# Altium project IO BOARD CERES-V6.PrjPcb
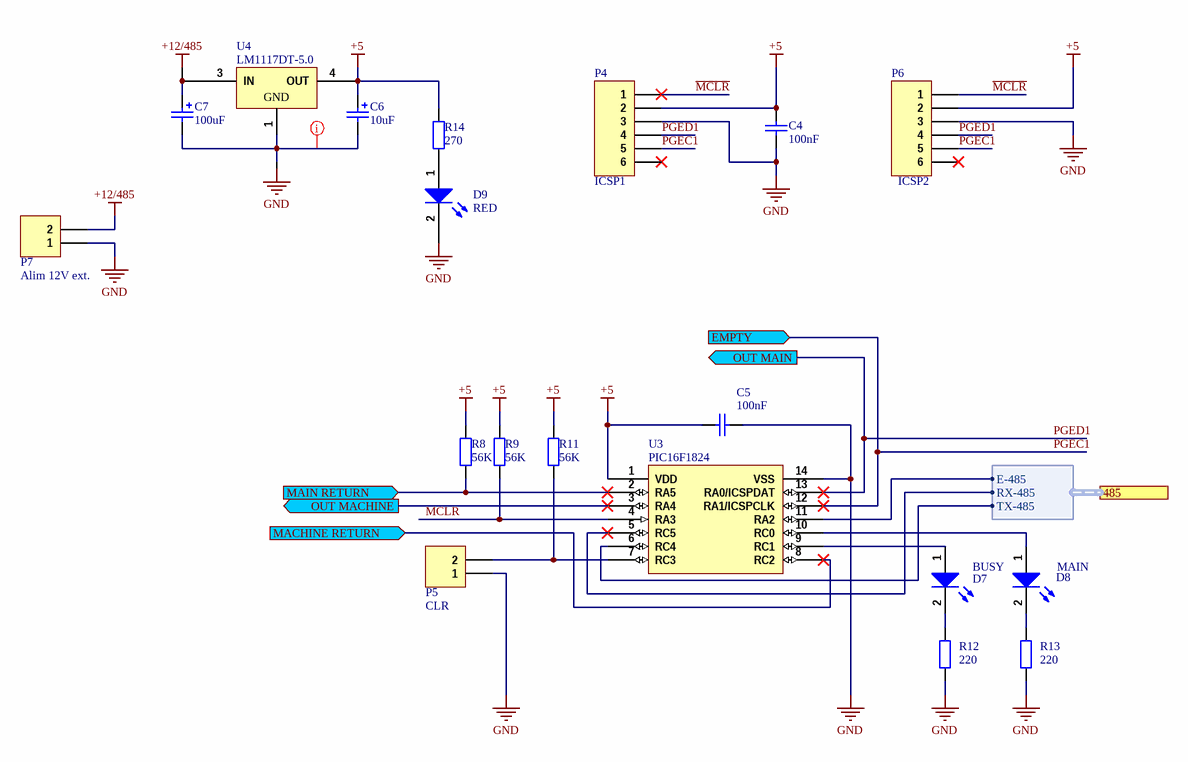
[diagram p0: MCU IO.SchDoc]
3 sheets, 63 parts. Net scope: flat (ports and power ports of the same name join across sheets).
Board file: IO BOARD CERES V6.PcbDoc
Sheets:
  MCU IO.SchDoc
  IO.SchDoc
  RS485 IO.SchDoc

## Sheet MCU IO.SchDoc: MCU
size A4; Date: 30 08 2013; Author: Rachid AKKOUCHE; CompanyName: RASoftware; DrawnBy: Rachid AKKOUCHE; Engineer: Rachid AKKOUCHE; Organization: RASoftware; Address1: 52 J03, rue de la crèche; Address3: 77100 MEAUX; Address4: FRANCE; DocumentNumber: BRA2013090103C2; Revision: C; SheetNumber: 2; SheetTotal: 4; Telephone: +33651604047; Email: rachid.akkouche@wanadoo.fr; Dessinepar: -; Verifiepar: -; Property: RASoftware; Time: 13:00; ProjectName: IO BOARD CERES-V3; Application_BuildNumber: 01

### Parts
C4  100nF  [C0805]
C5  100nF  [C0805]
C6  10uF  [KEMET_4]
C7  100uF  [Kemet_63]
D7  Indicator: BUSY  [0603-LEDR]  (hidden comment: HSMH-C190)
D8  MAIN  [0603-LEDV]  (value not drawn)
D9  Couleur: RED  [0603-LEDR]  (hidden comment: HSMH-C190)
P4  ICSP1  [TC2030]  (no BOM)
P5  CLR  [M20_1X2]
P6  ICSP2  [6SIP100]  (no BOM)
P7  Alim 12V ext.  [CO2P508]  (no BOM)
R8  56K  [R0805]
R9  56K  [R0805]
R11  56K  [R0805]
R12  220  [R0805]
R13  220  [R0805]
R14  270  [R0805]
U3  PIC16F1824  [so-14]
U4  LM1117DT-5.0  [SOT223]

### Ports
485 (harness EIA-485), EMPTY (in), MACHINE RETURN (in), MAIN RETURN (in), OUT MACHINE (out), OUT MAIN (out)

### Harnesses
EIA-485: TX-485, RX-485, E-485

### Nets
+5: C4.2 C5.2 C6.1 P4.2 P6.2 R8.2 R9.2 R11.2 R14.2 U3.1(VDD) U4.4(OUT)
+12/485: C7.1 P7.2 U4.3(IN)
GND: C4.1 C5.1 C6.2 C7.2 D9.2(K) P4.3 P5.1 P6.3 P7.1 R12.1 R13.1 U3.14(VSS) U4.1(GND)
~{MCLR}: P4.1 P6.1 R9.1 U3.4(RA3)
PGEC1: P4.5 P6.5 U3.12(RA1/ICSPCLK) ; port EMPTY
PGED1: P4.4 P6.4 U3.13(RA0/ICSPDAT) ; port OUT MAIN
NetC2_1: R8.1 U3.2(RA5) ; port MAIN RETURN
NetD7_1: D7.1(A) U3.9(RC1)
NetD7_2: D7.2(K) R12.2
NetD8_1: D8.1(A) U3.10(RC0)
NetD8_2: D8.2(K) R13.2
NetD9_1: D9.1(A) R14.1
NetP5_2: P5.2 R11.1 U3.7(RC3)
NetQ2_1: U3.3(RA4) ; port OUT MACHINE
NetR18_2: U3.11(RA2) ; port 485.E-485
NetU2_7: U3.8(RC2) ; port MACHINE RETURN
NetU3_5: U3.5(RC5) ; port 485.RX-485
NetU3_6: U3.6(RC4) ; port 485.TX-485

Not connected (* = marked no-connect by the designer): P4 6*; P6 6*

### Layout directives
rule Width Constraint [Pref Width = 0.55mm    Min Width = 0.254mm    Max Width = 2mm]: GND

### Notes on the sheet
- (near D8) MAIN
- Ce document est la propriété de
- Project:
- Il ne peut être divulgué sans l'accord écrit de l'un de ses représentants dûment mandaté
- Title:
- Number:
- Date:
- Time:
- Size:
- A4
- Revision:
- Sheet
- of
- 52 J03 rue de la crèche
- Draw by:
- 77100 Meaux

### Library data of the parts
C4 C5 = Cap 0805 100nF: Capacitor; Manufacturer: MULTICOMP; Manufacturer Part Number: MCCA000296; Supplier 1: Farnell; Supplier Part Number 1: 1759167; Pricing 1: 100=0,01, 500=0,008, 1000=0,006, 4000=0,005 (EUR); ComponentLink1URL: http://www.farnell.com/datasheets/1520827.pdf; ComponentLink1Description: http://www.farnell.com/datasheets/1520827.pdf
C6 = Cap Pol 10uF: Polarized Capacitor; Manufacturer: KEMET; Manufacturer Part Number: EXV106M025A9BAA; Dielectric Material: Aluminium; Voltage Rating: 25V; Tolerance: 20%; Ripple Current: 90mA; Impedance: 1.93R; Life (Hours): 3000Hour; Leakage Current: 3uA; Dissipation Factor: 0.14%; Lead Length: 1.8mm; ComponentLink1URL: http://www.farnell.com/datasheets/1500293.pdf; ComponentLink1Description: http://www.farnell.com/datasheets/1500293.pdf; Supplier 1: Farnell; Supplier Part Number 1: 2069174RL; Stock 1: 0; Mount: Surface Mount,PCB; Case/Package: Radial; Min Operating Temperature: -40°C; Max Operating Temperature: 105°C; Packaging: Tape and Reel; Package Quantity: 20000; Capacitance: 10uF; Voltage Rating (DC): 25V; Termination: SMD/SMT; Ripple Current (AC): 90mA; Voltage: 25V; ESR (Equivalent Series Resistance): 1.93R; Diameter: 4mm; Length: 5.4mm; Height: 5.4mm; Height - Seated (Max): 0.222inch; Lead Pitch: 1mm; REACH SVHC: No SVHC; ComponentLink2URL: https://datasheet.ciiva.com/22698/1500293-22698077.pdf; ComponentLink2Description: https://datasheet.ciiva.com/22698/1500293-22698077.pdf
C7 = Cap Pol 100uF: Polarized Capacitor; Manufacturer: EPCOS; Manufacturer Part Number: B41142A4107M; Product Range: EPCOS - B41142 Series; Capacité: 100; Tolérance de capacité: ± 20%; Tension: 16; Type de boîtier de condensateur: Radial Can - SMD; Diamètre: 6.3; Résistance, ESR: 0.16; Hauteur: 7.7; Courant d'ondulation c.a.: 300; Type de packaging: Cut Tape; Durée de vie @ température: 2000 heures @ 105; Température d'utilisation min: -55; Température de fonctionnement max..: 105; SVHC: No SVHC (19-Dec-2012); Impédance: 0.26; Température de fonctionnement: -55°C à +105; Température, ESR: 20; Type de boîtier: CMS; Supplier 1: Farnell; RoHS: YES; Pricing 1: 10=0,123, 50=0,095, 100=0,078, 250=0,07, 1000=0,062 (EUR); Courant d'ondulation c.a. à  100Hz: 300; Fréquence, impédance: 100; Longueur/hauteur: 7.7; Température, courant ondulatoire: 105; Température, impédance: 20; ComponentLink1URL: http://www.epcos.com/inf/20/30/db/alu_x/B41142.pdf; ComponentLink1Description: http://www.epcos.com/inf/20/30/db/alu_x/B41142.pdf; Supplier Part Number 1: 1735328
D7 D9 = HSMH-C190: Surface Mount Chip LED, Red; Manufacturer: AVAGO TECHNOLOGIES; Manufacturer Part Number: HSMH-C190.; Taille de lampe: 0.8mm x 1; Couleur de LED: Rouge; Intensité lumineuse: 17; Angle, vision: 170°; Courant, direct, If: 20; Tension, direct à  If: 1.8; Montage LED: CMS; Forme de lentille: Rectangulaire; Longueur d'onde typ.: 626; SVHC: No SVHC (19-Dec-2012); Dissipation de puissance: 65; Intensité lumineuse min. à  If: 2.8; Intensité lumineuse typique: 10; Largeur (externe): 0.8; Longueur d'onde dominante: 639; Longueur d'onde, crête: 630; Longueur/hauteur: 1.6; Matière: AlGaAs; Nombre de broches: 2; Orientation de montage opto: Dessus; Orientation sortie de lumière: Top Emitting; Température de fonctionnement: -30°C à +85; Température de fonctionnement max..: 85; Température, stockage min.: -40; Température d'utilisation min: -30; Tension, Vf max..: 2.6; Tension, Vf min.: 2.1; Type de LED: Standard; Supplier 1: Farnell; Supplier Part Number 1: 8554641; RoHS: YES; Pricing 1: 5=0,06, 25=0,059, 100=0,057, 250=0,052, 500=0,047 (EUR); MSL: MSL 2A - 4 semaines; Couleur, LED: Rouge; Profondeur: 0.8; Température, stockage max..: 85; Tension, Vf typ.: 1.8; ComponentLink1URL: http://www.farnell.com/datasheets/313031.pdf; ComponentLink1Description: http://www.farnell.com/datasheets/313031.pdf; ComponentLink2URL: http://www.farnell.com/datasheets/55927.pdf; ComponentLink2Description: http://www.farnell.com/datasheets/55927.pdf
  D7: Couleur: RED
  D9: Stock 1: 13902
D8 = HSMG-C190: Surface Mount Chip GREEN; Manufacturer: Broadcom Avago; Colour: Green,Yellow; Lens Colour: White,Clear; Forward Voltage: 2.2V; Luminous Intensity: 15mcd; Viewing Angle: 170°; Lens Style: Diffused,Colorless,Rectangular; Forward Current: 20mA; Power Rating: 52mW; Dominant Wavelength: 572nm; Lens Transparency: Diffused; Number of LEDs: 1; Reverse Voltage: 5V; ComponentLink1URL: http://www.farnell.com/datasheets/313031.pdf; ComponentLink1Description: http://www.farnell.com/datasheets/313031.pdf; ComponentLink2URL: http://www.farnell.com/datasheets/55927.pdf; ComponentLink2Description: http://www.farnell.com/datasheets/55927.pdf; ComponentLink3URL: https://datasheet.ciiva.com/11773/0900766b80ad69c9-11773861.pdf; ComponentLink3Description: https://datasheet.ciiva.com/11773/0900766b80ad69c9-11773861.pdf; ComponentLink4URL: https://datasheet.ciiva.com/15117/getdatasheetpartid-110413-15117483.pdf; ComponentLink4Description: https://datasheet.ciiva.com/15117/getdatasheetpartid-110413-15117483.pdf; ComponentLink5URL: https://datasheet.ciiva.com/31395/1487342-31395358.pdf; ComponentLink5Description: https://datasheet.ciiva.com/31395/1487342-31395358.pdf; ComponentLink6URL: https://datasheet.ciiva.com/29280/180659-da-01-en-chip-led-hsmg-c190-gelb-gruen-29280615.pdf; ComponentLink6Description: https://datasheet.ciiva.com/29280/180659-da-01-en-chip-led-hsmg-c190-gelb-gruen-29280615.pdf; ComponentLink7URL: https://datasheet.ciiva.com/46426/313031-46426519.pdf; ComponentLink7Description: https://datasheet.ciiva.com/46426/313031-46426519.pdf; ComponentLink8URL: https://datasheet.ciiva.com/46426/313031-46426520.pdf; ComponentLink8Description: https://datasheet.ciiva.com/46426/313031-46426520.pdf; ComponentLink9URL: https://datasheet.ciiva.com/14172/swseriehsmx-c150toc190-e-14172173.pdf; ComponentLink9Description: https://datasheet.ciiva.com/14172/swseriehsmx-c150toc190-e-14172173.pdf; Supplier 1: Farnell; Manufacturer Part Number: HSMG-C190; Stock 1: 0; Mount: Surface Mount; Case/Package: 0603; Number of Pins: 2; Case Code (Metric): 1608; Case Code (Imperial): 0603; Contact Plating: Gold; Min Operating Temperature: -40°C; Max Operating Temperature: 85°C; Packaging: Tape and Reel; Package Quantity: 1; Illumination Colour: Green; Test Current: 20mA; Wavelength: 572nm; Number of Elements: 1; Power Dissipation: 52mW; Max Power Dissipation: 52mW; Length: 1.6mm; Height: 0.8mm; Width: 0.8mm; Depth: 0.8mm; Radiation Hardening: No; REACH SVHC: No SVHC; Lead Free: Lead Free; Supplier Part Number 1: 8554609; Parameter 1: *
P4 = Header 6: Header, 6-Pin; Manufacturer: HARWIN; Manufacturer Part Number: M20-8770642; Type de connecteur: Contact fil-à-carte; Série: M20; Terminaison du contact: Montage en surface vertical; Genre: Embase; Nombre de contacts: 6; Nombre de rangées: 1; Pas: 2.54; Plaquage du contact: Or; Matériau du contact: Laiton; SVHC: No SVHC (19-Dec-2012); Supplier 1: Farnell; Supplier Part Number 1: 1517384; RoHS: YES; Stock 1: 3471; Pricing 1: 10=0,69, 20=0,66, 50=0,62, 100=0,6, 250=0,56, 500=0,49 (EUR); Pas, rang: 2.54; ComponentLink1URL: http://www.farnell.com/datasheets/1089524.pdf; ComponentLink1Description: http://www.farnell.com/datasheets/1089524.pdf; ComponentLink2URL: http://www.farnell.com/datasheets/5481.pdf; ComponentLink2Description: http://www.farnell.com/datasheets/5481.pdf
P5 = Header 2: Header, 2-Pin; Manufacturer: HARWIN; Manufacturer Part Number: M20-8770242; LatestRevisionDate: 17-Jul-2002; LatestRevisionNote: Re-released for DXP Platform.; Publisher: Altium Limited; Supplier 1: Farnell; Supplier Part Number 1: 1895211; RoHS: YES; Pricing 1: 10=0,137, 20=0,136, 50=0,135, 100=0,133, 250=0,128, 500=0,12 (EUR); ComponentLink1URL: http://www.farnell.com/cad/1330190.pdf; ComponentLink1Description: http://www.farnell.com/cad/1330190.pdf
P6 = Header 6: Header, 6-Pin; Manufacturer: TE CONNECTIVITY / AMP; Manufacturer Part Number: 4-103321-8.; Série: AMPMODU; Pas: 2.54; Nombre de rangées: 1; Nombre de contacts: 40; Genre: Embase; Terminaison du contact: A souder; Plaquage du contact: Etain; Matériau du contact: Bronze phosphoreux; Courant: 3; Matériau isolant: Thermoplastique; Organismes d'agrément: CSA, UL; Résistance d'isolement: 500; Température de fonctionnement max..: 105; Température d'utilisation min: -65; Type de boitier: Plastique noir UL94V-0; Supplier 1: Farnell; Supplier Part Number 1: 1098454; RoHS: YES; Stock 1: 2602; Pricing 1: 1=2,12, 50=1,79, 100=1,34, 500=1,14, 1000=1,05 (EUR); Méthode de terminaison: A souder; ComponentLink1URL: http://www.tycoelectronics.com/commerce/DocumentDelivery/DDEController?Action=srchrtrv&DocNm=4-103321-8&DocType=Customer+View+Model&DocLang=English; ComponentLink1Description: http://www.tycoelectronics.com/commerce/DocumentDelivery/DDEController?Action=srchrtrv&DocNm=4-103321-8&DocType=Customer+View+Model&DocLang=English; ComponentLink2URL: http://www.farnell.com/datasheets/38278.pdf; ComponentLink2Description: http://www.farnell.com/datasheets/38278.pdf
P7 = Header 2: Header, 2-Pin
R8 R9 R11 = Resistor 0805 56K: Resistor; Manufacturer: MULTICOMP; Manufacturer Part Number: MC0.1W08051%56KFR; Product Range: MULTICOMP - MC Series; Résistance: 56; Puissance: 100; Tolérance de résistance: ± 1%; Type de boîtier de résistance: 0805; Type de résistance: Couche épaisse; Coefficient de température: ± 100; Tension: 150; Type de packaging: Full Reel; Resistor Mounting: CMS; Resistor Terminals: (Non Disponible); Supplier 1: Farnell; RoHS: YES; Pricing 1: 5000=0,001 (EUR); MSL: (Non Applicable); ComponentLink1URL: http://www.farnell.com/datasheets/1716700.pdf; ComponentLink1Description: http://www.farnell.com/datasheets/1716700.pdf; Supplier Part Number 1: 2129258
R12 R13 = Resistor 0805 220: Resistor; Manufacturer: MULTICOMP; Manufacturer Part Number: MC01W08051220R; Gamme de produit: MULTICOMP - MC Series; Puissance: 100; Tolérance de résistance: ± 1%; Type de boîtier de résistance: 0805; Type de résistance: Couche épaisse; Coefficient de température: ± 100; Tension: 150; Type de packaging: Bande et Bobine; SVHC: No SVHC (20-Jun-2013); Montage de résistance: CMS; Quantité par bobine: 5000; Supplier 1: Farnell; RoHS: YES; Stock 1: 199995; Pricing 1: 5000=0,001, 25000=0,0009, 50000=0,0008 (EUR); Résistance: 220; MSL: -; ComponentLink1URL: http://www.farnell.com/datasheets/1729047.pdf; ComponentLink1Description: http://www.farnell.com/datasheets/1729047.pdf; Supplier Part Number 1: 2129060
R14 = Resistor 0805 1K: Resistor; Manufacturer: MULTICOMP; Manufacturer Part Number: MC0.1W08051%1KFR; Product Range: MULTICOMP - MC Series; Résistance: 1; Puissance: 100; Tolérance de résistance: ± 1%; Type de boîtier de résistance: 0805; Type de résistance: Couche épaisse; Coefficient de température: ± 100; Tension: 150; Type de packaging: Full Reel; Resistor Mounting: CMS; Supplier 1: Farnell; RoHS: YES; Pricing 1: 5000=0,001 (EUR); MSL: MSL 1 - Illimité; ComponentLink1URL: http://www.farnell.com/datasheets/1716700.pdf; ComponentLink1Description: http://www.farnell.com/datasheets/1716700.pdf; Supplier Part Number 1: 2129113
U3 = PIC16(L)F1824: 14 Pin Flash Microcontrollers with XLP Technology; Manufacturer: MICROCHIP; Manufacturer Part Number: PIC16F1824-I/SL; Supplier 1: Farnell; RoHS: YES; Stock 1: 516; ComponentLink1URL: http://www.farnell.com/datasheets/1669488.pdf; ComponentLink1Description: http://www.farnell.com/datasheets/1669488.pdf; ComponentLink2URL: http://www.farnell.com/cad/1689044.zip; ComponentLink2Description: http://www.farnell.com/cad/1689044.zip; Supplier Part Number 1: 1814945
U4 = LM1117DT-5.0: 800mA Low-Dropout Linear Regulator, 3-pin TO-252; Manufacturer: TEXAS INSTRUMENTS; Manufacturer Part Number: LM1117MP-5.0; Supplier 1: Farnell; Supplier Part Number 1: 9778209; RoHS: YES; Pricing 1: 1=0,9, 10=0,86, 100=0,73 (EUR); ComponentLink1URL: http://www.farnell.com/datasheets/1685500.pdf; ComponentLink1Description: http://www.farnell.com/datasheets/1685500.pdf; ComponentLink2URL: http://www.farnell.com/cad/1562101.zip; ComponentLink2Description: http://www.farnell.com/cad/1562101.zip

## Sheet IO.SchDoc: IO
size A4; Date: 31 08 2013; Author: Rachid AKKOUCHE; CompanyName: RASoftware; DrawnBy: Rachid AKKOUCHE; Engineer: Rachid AKKOUCHE; Organization: RASoftware; Address1: 52 J03, rue de la crèche; Address2: 77100 MEAUX; Address3: FRANCE; DocumentNumber: BRA2013090103C3; Revision: C; SheetNumber: 3; SheetTotal: 4; Telephone: +33651604047; Email: rachid.akkouche@wanadoo.fr; Dessinepar: -; Verifiepar: -; Property: RASoftware; PageSetup: Record=PageOptions|CenterHorizontal=True|CenterVertical=True|PrintScale=0.97|XCorrection=1.00|YCorrection=1.00|PrintKind=0|BorderSize=5000000|LeftOffset=0|BottomOffset=0|Orientation=2|PaperLength=1000|PaperWidth=1000|Scale=100|PaperSource=7|PrintQuality=-3|MediaType=1|DitherType=10|PrintScaleMode=1|PaperKind=16K|PaperIndex=409; Time: 13:22
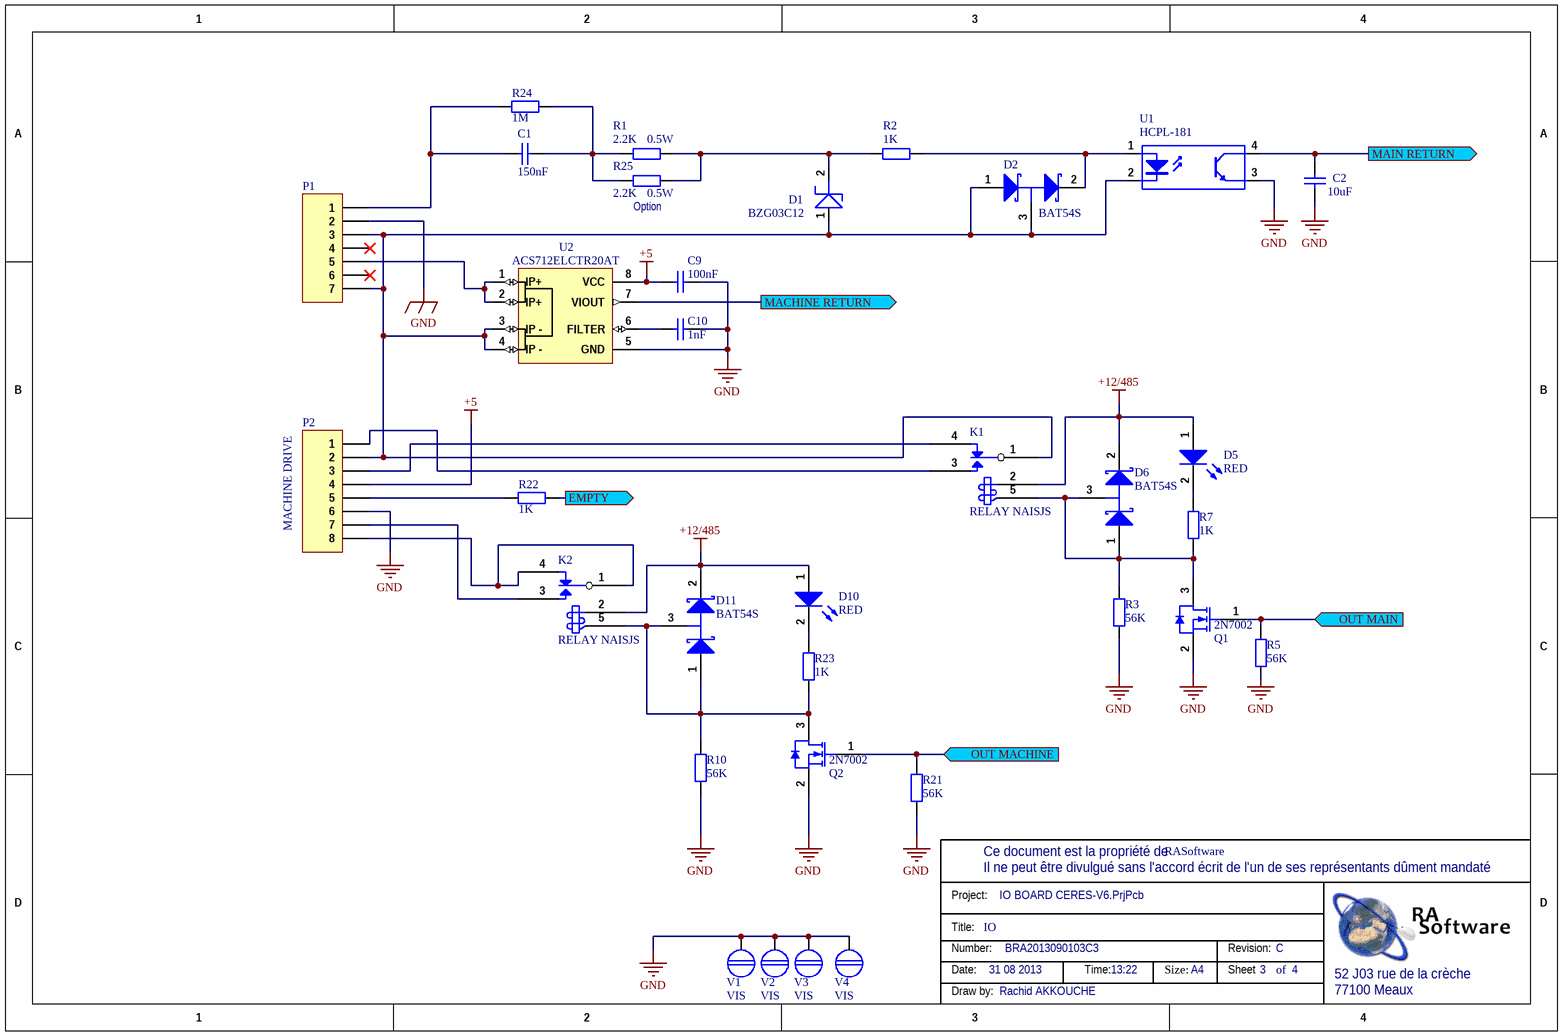
[diagram p1: IO.SchDoc]

### Parts
C1  150nF  [C1210]
C2  10uF  [C0805]
C9  100nF  [C0805]
C10  1nF  [C0805]
D1  BZG03C12  [sma]
D2  BAT54S  [SOT23]
D5  Couleur: RED  [0603-LEDR]  (hidden comment: HSMH-C190)
D6  BAT54S  [SOT23]
D10  Couleur: RED  [0603-LEDR]  (hidden comment: HSMH-C190)
D11  BAT54S  [SOT23]
K1  RELAY NAISJS  [RELAIG5L]
K2  RELAY NAISJS  [RELAIG5L]
P1  Header 7  [CO7P508-90]  (value not drawn)
P2  Header 8  [CO8P508 - 90°]  (value not drawn)
Q1  2N7002  [SOT23]
Q2  2N7002  [SOT23]
R1  2.2K  Power: 0.5W  [1206]
R2  1K  [R0805]
R3  56K  [R0805]
R5  56K  [R0805]
R7  1K  [R0805]
R10  56K  [R0805]
R21  56K  [R0805]
R22  1K  [R0805]
R23  1K  [R0805]
R24  1M  [R1206]
R25  2.2K  Power: 0.5W  [1206]
U1  HCPL-181  [OPTO-4PIN]
U2  Supplier Part Number 1: ACS712ELCTR20AT  [SOIC8]  (hidden comment: ACS712)
V1  VIS  [vis42]
V2  VIS  [vis42]
V3  VIS  [vis42]
V4  VIS  [vis42]

### Ports
EMPTY (out), MACHINE RETURN (out), MAIN RETURN (out), OUT MACHINE (in), OUT MAIN (in)

### Nets
+5: C9.2 P2.4 U2.8(VCC)
+12/485: D5.1(A) D6.2(K) D10.1(A) D11.2(K) K1.2(COIL1) K2.2(COIL1)
GND: C2.2 C9.1 C10.2 P1.2 P2.6 Q1.2(S) Q2.2(S) R3.1 R5.1 R10.1 R21.1 U1.3(E) U2.5(GND) V1.1 V2.1 V3.1 V4.1
PGEC1: R22.1 ; port EMPTY
PGED1: Q1.1(G) R5.2 ; port OUT MAIN
NetC1_1: C1.1 P1.1 R24.2
NetC1_2: C1.2 R1.2 R24.1 R25.2
NetC2_1: C2.1 U1.4(C) ; port MAIN RETURN
NetC10_1: C10.1 U2.6(FILTER)
NetD1_1: D1.1 D2.1(A) D2.3(C) K1.1(COMMON) P1.3 P1.7 P2.2 U1.2(K) U2.3(IP_-) U2.4(IP_-)
NetD1_2: D1.2 R1.1 R2.1 R25.1
NetD2_2: D2.2(K) R2.2 U1.1(A)
NetD5_2: D5.2(K) R7.2
NetD6_1: D6.1(A) D6.3(C) K1.5(COIL2) Q1.3(D) R3.2 R7.1
NetD10_2: D10.2(K) R23.2
NetD11_1: D11.1(A) D11.3(C) K2.5(COIL2) Q2.3(D) R10.2 R23.1
NetK1_3: K1.3(NO) P2.1
NetK1_4: K1.4(NC) P2.3
NetK2_1: K2.1(COMMON) K2.4(NC) P2.8
NetK2_3: K2.3(NO) P2.7
NetP1_5: P1.5 U2.1(IP+) U2.2(IP+)
NetP2_5: P2.5 R22.2
NetQ2_1: Q2.1(G) R21.2 ; port OUT MACHINE
NetU2_7: U2.7(VIOUT) ; port MACHINE RETURN

Not connected (* = marked no-connect by the designer): P1 4* 6*

### Notes on the sheet
- (near R25) Option
- (near P2) MACHINE DRIVE
- Ce document est la propriété de
- Project:
- Il ne peut être divulgué sans l'accord écrit de l'un de ses représentants dûment mandaté
- Title:
- Number:
- Date:
- Time:
- Size:
- A4
- Revision:
- Sheet
- of
- 52 J03 rue de la crèche
- Draw by:
- 77100 Meaux

### Library data of the parts
C1 = Cap: Capacitor; Manufacturer: KEMET; Manufacturer Part Number: C1210V154KCRACTU; Gamme de produit: KEMET - ArcShield V Series; Capacité: 0.15; Tolérance de capacité: ± 10%; Diélectrique: X7; Tension: 500; Boîtier de condensateur Céramique: 1210 [3225 Metric]; Température d'utilisation min: -55; Température de fonctionnement max..: 125; Type de packaging: Bande découpée; SVHC: No SVHC (16-Dec-2013); Bornes de condensateur: CMS; Température de fonctionnement: -55°C à +125; Type de boîtier de condensateur: 1210 [3225 Metric]<!--FANDB--><div class="features-and-benefits-container"></div>; Supplier 1: Farnell; Supplier Part Number 1: 2085200; RoHS: YES; Pricing 1: 10=0,34, 50=0,28, 100=0,154, 500=0,125, 2500=0,097 (EUR); MSL: MSL 1 - Illimité; Tolérance de capacité ±: ± 10%; ComponentLink1URL: http://www.farnell.com/datasheets/1698777.pdf; ComponentLink1Description: http://www.farnell.com/datasheets/1698777.pdf
C2 = Cap 0805 1uF: Capacitor; Manufacturer: YAGEO; Manufacturer Part Number: CC0805KKX5R5BB106; Unit: pcs; SuppliedAmount: 3000; MinAmount: 100; Capacitor type: ceramic; Capacitor kind: MLCC; Capacitance: 10µF; Operating voltage: 6.3V; Dielectric: X5R; Tolerance: ±10%; Supplier Part Number 1: CC0805KKX5R5106; Category: 0805 MLCC SMD Capacitors; Stock 1: 19000; Weight: 0,034; Multiples: 100; Mounting: SMD; Case: 0805; ComponentLink1URL: http://www.tme.eu/en/details/cc0805kkx5r5106/0805-mlcc-smd-capacitors/yageo/cc0805kkx5r5bb106/; ComponentLink1Description: http://www.tme.eu/en/details/cc0805kkx5r5106/0805-mlcc-smd-capacitors/yageo/cc0805kkx5r5bb106/
C9 = Cap 0805 100nF: as C4 on sheet MCU IO; Supplier 1: Farnell; Supplier Part Number 1: 1759167; Pricing 1: 100=0,01, 500=0,008, 1000=0,006, 4000=0,005 (EUR); ComponentLink1URL: http://www.farnell.com/datasheets/1520827.pdf; ComponentLink1Description: http://www.farnell.com/datasheets/1520827.pdf
C10 = Cap 0805 1nF: Capacitor; Manufacturer: SAMSUNG; Manufacturer Part Number: CL05B102KB5NNNC; Unit: pcs; SuppliedAmount: 10000; MinAmount: 300; Multiples: 100; Type de condensateur: céramique; Tye de condensateur: MLCC; Tension de travail: 50V; Diélectrique: X7R; Tolérance: ±10%; Montage: SMD; Boîtier: 0402; Température de travail: -55...125°C; Supplier 1: TME; Category: Condensateurs MLCC SMD 0402; Stock 1: 25000; Pricing 1: 300=0,00208, 1000=0,00124, 10000=0,00069, 40000=0,00066, 100000=0,00064 (EUR); Weight: 0,012; Price Type: NET; Capacité: 1nF; Fabricant: SAMSUNG; ComponentLink1URL: http://www.tme.eu/fr/details/cl05b102kb5nnnc/condensateurs-mlcc-smd-0402/samsung/; ComponentLink1Description: http://www.tme.eu/fr/details/cl05b102kb5nnnc/condensateurs-mlcc-smd-0402/samsung/; Supplier Part Number 1: CL05B102KB5NNNC
D1 = DZ: Manufacturer: VISHAY; Manufacturer Part Number: BZG03C12TR3; Supplier 1: Farnell; Supplier Part Number 1: 9398090; RoHS: YES; Pricing 1: 5=0,62, 100=0,37, 1500=0,26, 3000=0,138, 7000=0,135, 30000=0,132, 30000=0,129 (EUR); ComponentLink1URL: http://www.farnell.com/datasheets/69906.pdf; ComponentLink1Description: http://www.farnell.com/datasheets/69906.pdf
D2 D6 D11 = BAT54S: Schottky Barrier Double Diode; Manufacturer: MULTICOMP; Courant, If moy.: 200; Tension, Vrrm: 30; Tension, Vf max..: 400; Temps trr max.: 5; Courant, Ifs max.: 600; Type de boîtier diode: SOT-23; Nombre de broches: 3; SVHC: No SVHC (19-Dec-2012); Configuration diode: Dual Series; Température, Tj max..: 150; Type de terminaison: SMD; Température d'utilisation min: -55; Courant, If, Vf: 10; Courant, Ir, max..: 2; Marquage, CMS: L44; Température de fonctionnement: -55°C à +150; Supplier 1: Farnell; Supplier Part Number 1: 1621835; Manufacturer Part Number: BAT54S; RoHS: YES; Stock 1: 52055; Pricing 1: 10=0,102, 250=0,074, 1000=0,06, 3000=0,053 (EUR); Diode Type: Schottky; Type de boîtier: SOT-23; courant Ifsm: 600; ComponentLink1URL: http://www.farnell.com/datasheets/1317753.pdf; ComponentLink1Description: http://www.farnell.com/datasheets/1317753.pdf; Température de fonctionnement max..: 150
D5 D10 = HSMH-C190: as D7 on sheet MCU IO; Supplier 1: Farnell; Supplier Part Number 1: 8554641; RoHS: YES; Pricing 1: 5=0,06, 25=0,059, 100=0,057, 250=0,052, 500=0,047 (EUR); MSL: MSL 2A - 4 semaines; Couleur, LED: Rouge; Profondeur: 0.8; Température, stockage max..: 85; Tension, Vf typ.: 1.8; ComponentLink1URL: http://www.farnell.com/datasheets/313031.pdf; ComponentLink1Description: http://www.farnell.com/datasheets/313031.pdf; ComponentLink2URL: http://www.farnell.com/datasheets/55927.pdf; ComponentLink2Description: http://www.farnell.com/datasheets/55927.pdf
K1 K2 = RELAY NAISJS: Manufacturer: OMRON ELECTRONIC COMPONENTS; Manufacturer Part Number: G5LA1A412DC; Type de relais: Puissance; Tension, bobine c.c. nom.: 12; Courant de contact max..: 10; Tension AC nominale du contact: 250; Tension DC nominale du contact: 24; Résistance, bobine: 400; Configuration des contacts: SPST-NO; Type de bobine: CC; Courant de bobine: 30; Puissance de fonctionnement nominale: 360; Montage relais: Traversant; Largeur (externe): 15.8; Profondeur: 19.8; SVHC: No SVHC (20-Jun-2013); Supplier 1: Farnell; Supplier Part Number 1: 2213790; RoHS: YES; Pricing 1: 1=0,84, 10=0,74, 50=0,66, 100=0,59, 250=0,54 (EUR); Hauteur, dimension externe: 15.8; ComponentLink1URL: http://www.farnell.com/datasheets/1648381.pdf; ComponentLink1Description: http://www.farnell.com/datasheets/1648381.pdf
P1 = Header 7: Header, 7-Pin; Manufacturer: FCI; Manufacturer Part Number: 20020110-H071A01LF; Anschlussart: Löten; Anzahl der Kontakte: 7; Anzahl der Reihen: 1; Betriebsspannung: 300 V ac; Breite: 12mm; Farbe: Grün; Gehäuseausrichtung: Rechtwinklig; Gender: Male; Länge: 37.56mm; Montagetyp: Durchsteckmontage; Nennstrom: 12A; Raster: 5.08mm; Serie: 06-508; Tiefe: 8.5mm; Typ: Stiftsockel; Currency: ÿNILÿ; Product StockNumber: 707-5477; Connecteur femelle: 790-0714; LatestRevisionDate: 17-Jul-2002; LatestRevisionNote: Re-released for DXP Platform.; Publisher: Altium Limited; Supplier 1: RS-Components; Supplier Part Number 1: 707-5477; RoHS: Compliant; Category: Steckverbinder; Stock 1: 0; Pricing 1: 5=0,778, 375=0,682, 1250=0,584, 2500=0,486, 5000=0,39 (ÿNILÿ); Material: Nylon; Product Status: ÿNILÿ; Future Stock Date: ÿNILÿ
P2 = Header 8: Header, 8-Pin; Manufacturer: CAMDENBOSS; Manufacturer Part Number: CTB9350/8AO; Gamme de produit: CAMDENBOSS - CTB9350; Type de terminaison de contact: Traversant; Genre: Mâle; Nombre de contacts: 8; Nombre de rangées: 1; Pas: 5; Plaquage du contact: Cuivre; Matériau du contact: Laiton; SVHC: No SVHC (16-Jun-2014); Couleur: vert; Courant: 12; Inflammabilité: UL94V-0; Matériau, vis: Acier; Méthode de terminaison: A souder; Taille du filetage: M3; Température de fonctionnement max..: 125; Température d'utilisation min: -20; Tension nominale Vac: 380; Terminaison du contact: Traversant à angle droit<!--FANDB--><div class="features-and-benefits-container"></div>; Connecteur femelle: 3881891; LatestRevisionDate: 17-Jul-2002; LatestRevisionNote: Re-released for DXP Platform.; Publisher: Altium Limited; Supplier 1: Farnell; Supplier Part Number 1: 3882251; RoHS: YES; Pricing 1: 1=0,963, 25=0,847, 100=0,793, 250=0,732, 700=0,659, 3000=0,581, 3000=0,523, 20000=0,471 (EUR); ComponentLink1URL: http://www.farnell.com/datasheets/1708040.pdf; ComponentLink1Description: http://www.farnell.com/datasheets/1708040.pdf
Q1 Q2 = 2N7002: N-channel Enhancement Mode Field-effect Transistor; Manufacturer: FAIRCHILD SEMICONDUCTOR; Supplier 1: Farnell; Supplier Part Number 1: 9845313; Manufacturer Part Number: 2N7002; RoHS: YES; Pricing 1: 5=0,138, 25=0,13, 100=0,059, 1000=0,049, 3000=0,026, 6000=0,0234 (EUR); ComponentLink1URL: http://www.farnell.com/datasheets/660093.pdf; ComponentLink1Description: http://www.farnell.com/datasheets/660093.pdf; ComponentLink2URL: http://www.farnell.com/datasheets/410597.pdf; ComponentLink2Description: http://www.farnell.com/datasheets/410597.pdf
R1 R25 = Resistor 2.2K 1/2W: Resistor 1/2W; Manufacturer: ROYAL OHM; Manufacturer Part Number: HP06W2F2201T5E; Unit: pcs; SuppliedAmount: 5000; MinAmount: 50; Multiples: 1; Resistance: 2.2kΩ; Tolerance: ±1%; Max. operating voltage: 200V; Max. overload voltage: 400V; Supplier 1: TME; Category: 1206 SMD Resistors; Stock 1: 7150; Pricing 1: 50=0.01633, 250=0.00998, 1000=0.00726, 5000=0.00526, 15000=0.00481 (EUR); Weight: 0.035; Resistor type: thick film; Mounting: SMD; Case: 1206; Operating temperature: -55...155°C; Price Type: NET; ComponentLink1URL: http://static.tme.eu/products_pics/f/9/e/f9e1b74986ef91100415c120c46fcd3c/59135.jpg; ComponentLink1Description: http://static.tme.eu/products_pics/f/9/e/f9e1b74986ef91100415c120c46fcd3c/59135.jpg; Supplier Part Number 1: HP06-2K21%
R2 = Res2: Resistor; Manufacturer: MULTICOMP; Manufacturer Part Number: MC0.1W08051%1KFR; Product Range: MULTICOMP - MC Series; Résistance: 1; Puissance: 100; Tolérance de résistance: ± 1%; Type de boîtier de résistance: 0805; Type de résistance: Couche épaisse; Coefficient de température: ± 100; Tension: 150; Type de packaging: Full Reel; Resistor Mounting: CMS; Supplier 1: Farnell; Supplier Part Number 1: 2129113; RoHS: YES; Stock 1: 599995; Pricing 1: 5000=0,001 (EUR); MSL: MSL 1 - Illimité; ComponentLink1URL: http://www.farnell.com/datasheets/1636796.pdf; ComponentLink1Description: http://www.farnell.com/datasheets/1636796.pdf
R3 R5 R10 R21 = Resistor 0805 56K: as R8 on sheet MCU IO; Supplier 1: Farnell; RoHS: YES; Pricing 1: 5000=0,001 (EUR); MSL: (Non Applicable); ComponentLink1URL: http://www.farnell.com/datasheets/1716700.pdf; ComponentLink1Description: http://www.farnell.com/datasheets/1716700.pdf; Supplier Part Number 1: 2129258
R7 R22 R23 = Resistor 0805 1K: as R14 on sheet MCU IO; Supplier 1: Farnell; RoHS: YES; Pricing 1: 5000=0,001 (EUR); MSL: MSL 1 - Illimité; ComponentLink1URL: http://www.farnell.com/datasheets/1716700.pdf; ComponentLink1Description: http://www.farnell.com/datasheets/1716700.pdf; Supplier Part Number 1: 2129113
R24 = Resistor 1206 1M: Resistor; Manufacturer: Multicomp; Manufacturer Part Number: MCHP06W2F1004T5E; Resistance: 1MR; Power Rating: 500mW; Tolerance: 1%; Voltage Rating: 200V; Temperature Coefficient: 100ppm/°C; Voltage Rating (DC): 50V; ComponentLink1URL: http://www.farnell.com/datasheets/2254497.pdf; ComponentLink1Description: http://www.farnell.com/datasheets/2254497.pdf; ComponentLink2URL: http://www.farnell.com/datasheets/1718548.pdf; ComponentLink2Description: http://www.farnell.com/datasheets/1718548.pdf; ComponentLink3URL: http://www.farnell.com/cad/1697909.zip; ComponentLink3Description: http://www.farnell.com/cad/1697909.zip; Supplier 1: Farnell; Stock 1: 0; Case/Package: 1206; Number of Pins: 2; Case Code (Metric): 3216; Case Code (Imperial): 1206; Min Operating Temperature: -55°C; Max Operating Temperature: 155°C; Packaging: Cut Tape; Composition: Thick Film; Width: 1.55mm; REACH SVHC: No SVHC; ComponentLink4URL: https://datasheet.ciiva.com/7918/1739503-7918901.pdf; ComponentLink4Description: https://datasheet.ciiva.com/7918/1739503-7918901.pdf; ComponentLink5URL: https://datasheet.ciiva.com/7392/43481-7392806.pdf; ComponentLink5Description: https://datasheet.ciiva.com/7392/43481-7392806.pdf; Supplier Part Number 1: 1576679
U1 = Optoisolator1: 4-Pin Phototransistor Optocoupler; Manufacturer: AVAGO TECHNOLOGIES; Manufacturer Part Number: HCPL-181-00AE; Supplier 1: Farnell; Supplier Part Number 1: 1244526RL; RoHS: YES; Pricing 1: 150=0,27, 250=0,217, 500=0,191, 2000=0,143, 2000=0,14, 20000=0,137 (EUR); ComponentLink1URL: http://www.farnell.com/datasheets/317140.pdf; ComponentLink1Description: http://www.farnell.com/datasheets/317140.pdf
U2 = ACS712: HALL EFFECT CURRENT SENSOR; Manufacturer: ALLEGRO MICROSYSTEMS; Manufacturer Part Number: ACS712ELCTR-20A-T; Unit: pcs; SuppliedAmount: 10; MinAmount: 1; Type de capteur: Hall effet; Tension d'alimentation: 8V DC; Courant d'entrée: ± 20A; Température de travail: -40...85°C; Supplier 1: TME; Category: Capteurs de Hall; Stock 1: 844; Pricing 1: 1=3,39, 3=3,16, 10=2,92 (EUR); Weight: 0,336; Multiples: 1; Price Type: NET; Fabricant: ALLEGRO MICROSYSTEMS; ComponentLink1URL: http://www.tme.eu/fr/details/acs712elctr20at/capteurs-de-hall/allegro-microsystems/acs712elctr-20a-t/; ComponentLink1Description: http://www.tme.eu/fr/details/acs712elctr20at/capteurs-de-hall/allegro-microsystems/acs712elctr-20a-t/

## Sheet RS485 IO.SchDoc: RS-485
size A4; Date: 31 08 2013; Author: Rachid AKKOUCHE; CompanyName: RASoftware; DrawnBy: Rachid AKKOUCHE; Engineer: Rachid AKKOUCHE; Organization: RASoftware; Address1: 52 J03, rue de la crèche; Address2: 77100 MEAUX; Address3: FRANCE; DocumentNumber: BRA2013090103C4; Revision: C; SheetNumber: 4; SheetTotal: 4; Telephone: +33651604047; Email: rachid.akkouche@wanadoo.fr; Dessinepar: -; Verifiepar: -; Property: RASoftware; Time: 13:22
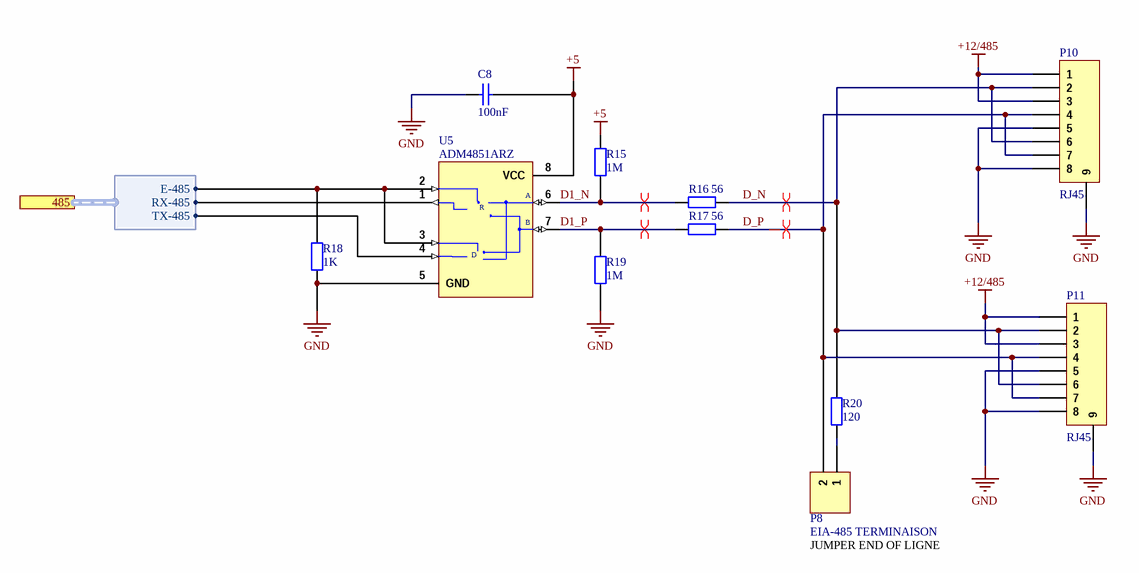
[diagram p2: RS485 IO.SchDoc]

### Parts
C8  100nF  [C0805]
P8  EIA-485 TERMINAISON  [M20_1X2]
P10  RJ45  [RJ45_8-5406721-1]
P11  RJ45  [RJ45_8-5406721-1]
R15  1M  [R0805]
R16  56  [R0805]
R17  56  [R0805]
R18  1K  [R0805]
R19  1M  [R0805]
R20  120  [R0805]
U5  ADM4851ARZ  [SOIC8]

### Ports
485 (harness EIA-485)

### Harnesses
EIA-485: TX-485, RX-485, E-485

### Nets
+5: C8.1 R15.2 U5.8(VCC)
+12/485: P10.1 P10.3 P11.1 P11.3
GND: C8.2 P10.5 P10.8 P10.9 P11.5 P11.8 P11.9 R18.1 R19.1 U5.5(GND)
D1_N: R15.1 R16.1 U5.6(A)
D1_P: R17.1 R19.2 U5.7(B)
D_N: P10.2 P10.6 P11.2 P11.6 R16.2 R20.2
D_P: P8.2 P10.4 P10.7 P11.4 P11.7 R17.2
NetP8_1: P8.1 R20.1
NetR18_2: R18.2 U5.2(~{RE}) U5.3(DE) ; port 485.E-485
NetU3_5: U5.1(RO) ; port 485.RX-485
NetU3_6: U5.4(DI) ; port 485.TX-485

### Layout directives
differential pair: D1_N, D1_P, D_N, D_P

### Notes on the sheet
- JUMPER END OF LIGNE
- Ce document est la propriété de
- Project:
- Il ne peut être divulgué sans l'accord écrit de l'un de ses représentants dûment mandaté
- Title:
- Number:
- Date:
- Time:
- Size:
- A4
- Revision:
- Sheet
- of
- 52 J03 rue de la crèche
- Draw by:
- 77100 Meaux
- (in symbol MAX485ESA) R; D

### Library data of the parts
C8 = Cap 0805 100nF: as C4 on sheet MCU IO; Supplier 1: Farnell; Supplier Part Number 1: 1759167; Pricing 1: 100=0,01, 500=0,008, 1000=0,006, 4000=0,005 (EUR); ComponentLink1URL: http://www.farnell.com/datasheets/1520827.pdf; ComponentLink1Description: http://www.farnell.com/datasheets/1520827.pdf
P8 = Header 2: Header, 2-Pin; Manufacturer: HARWIN; Manufacturer Part Number: M20-8770242; Product Range: HARWIN - M20-87 Series; Terminaison du contact: PCB; Genre: Connecteur mâle; Nombre de contacts: 2; Nombre de rangées: 1; Pas: 2.54; Plaquage du contact: Or; Matériau du contact: Laiton; SVHC: No SVHC (20-Jun-2013); LatestRevisionDate: 17-Jul-2002; LatestRevisionNote: Re-released for DXP Platform.; Publisher: Altium Limited; Supplier 1: Farnell; Supplier Part Number 1: 1895211; RoHS: YES; Pricing 1: 10=0,137, 20=0,136, 50=0,135, 100=0,133, 250=0,128, 500=0,12 (EUR); ComponentLink1URL: http://www.farnell.com/cad/1330190.pdf; ComponentLink1Description: http://www.farnell.com/cad/1330190.pdf
P10 P11 = Header 8: Header, 8-Pin; Manufacturer: TE CONNECTIVITY / AMP; Manufacturer Part Number: 5406721-1; Supplier 1: Farnell; Supplier Part Number 1: 2452589; RoHS: YES; Stock 1: 1018; Pricing 1: 10=1.33, 50=1.2, 100=1.1, 250=1.02, 500=0.946, 1000=0.927 (EUR); ComponentLink1URL: http://www.farnell.com/cad/1637338.pdf; ComponentLink1Description: http://www.farnell.com/cad/1637338.pdf
R15 R19 = Resistor 0805 1M: Resistor
R16 R17 = Resistor 0805 56: Resistor; Manufacturer: MULTICOMP; Manufacturer Part Number: MC01W0805156R; Product Range: MULTICOMP - MC Series; Puissance: 100; Tolérance de résistance: ± 1%; Type de boîtier de résistance: 0805; Type de résistance: Couche épaisse; Coefficient de température: ± 200; Tension: 150; Type de packaging: Full Reel; SVHC: No SVHC (20-Jun-2013); Resistor Mounting: CMS; Supplier 1: Farnell; RoHS: YES; Pricing 1: 5000=0,001 (EUR); Résistance: 56; MSL: (Non Applicable); ComponentLink1URL: http://www.farnell.com/datasheets/1729047.pdf; ComponentLink1Description: http://www.farnell.com/datasheets/1729047.pdf; Supplier Part Number 1: 2129016
R18 = Resistor 0805 1K: as R14 on sheet MCU IO; Supplier 1: Farnell; RoHS: YES; Pricing 1: 5000=0,001 (EUR); MSL: MSL 1 - Illimité; ComponentLink1URL: http://www.farnell.com/datasheets/1716700.pdf; ComponentLink1Description: http://www.farnell.com/datasheets/1716700.pdf; Supplier Part Number 1: 2129113
R20 = Resistor 0805 120: Resistor; Manufacturer: MULTICOMP; Manufacturer Part Number: MC01W080516K49; Product Range: MULTICOMP - MC Series; Résistance: 6.49; Puissance: 100; Tolérance de résistance: ± 1%; Type de boîtier de résistance: 0805; Type de résistance: Couche épaisse; Coefficient de température: ± 100; Tension: 150; Type de packaging: Full Reel; SVHC: No SVHC (20-Jun-2013); Resistor Mounting: CMS; Supplier 1: Farnell; RoHS: YES; Pricing 1: 5000=0,001 (EUR); MSL: (Non Applicable); ComponentLink1URL: http://www.farnell.com/datasheets/1729047.pdf; ComponentLink1Description: http://www.farnell.com/datasheets/1729047.pdf; Supplier Part Number 1: 2129181
U5 = MAX485ESA: Low-Power, Slew-Rate-Limited RS-485/RS-422 Transceiver; Manufacturer: ANALOG DEVICES; Type de driver: Émetteur-récepteur de ligne différentiel; Type d'interface CI: RS422, RS485; Nombre de drivers: 1; Tension, alimentation min.: 4.75; Tension, alimentation max..: 5.25; Type de boîtier CI Driver: NSOIC; Nombre de broches: 8; Température d'utilisation min: -40; Température de fonctionnement max..: 85; SVHC: No SVHC (20-Jun-2013); Supplier 1: Farnell; Supplier Part Number 1: 2313594; Manufacturer Part Number: ADM4851ARZ; RoHS: YES; Pricing 1: 1=1,39, 10=1,13, 100=1,01, 250=0,9, 500=0,79 (EUR); MSL: MSL 1 - Illimité; ComponentLink1URL: http://www.analog.com/static/imported-files/data_sheets/ADM4850_4851_4852_4853_4854_4855_4856_4857.pdf; ComponentLink1Description: http://www.analog.com/static/imported-files/data_sheets/ADM4850_4851_4852_4853_4854_4855_4856_4857.pdf; ComponentLink2URL: http://www.farnell.com/cad/1713403.zip; ComponentLink2Description: http://www.farnell.com/cad/1713403.zip

## Nets that join several sheets
+5: MCU IO (11 pins), IO (C9.2 P2.4 U2.8), RS485 IO (C8.1 R15.2 U5.8)
+12/485: MCU IO (C7.1 P7.2 U4.3), IO (6 pins), RS485 IO (P10.1 P10.3 P11.1 P11.3)
GND: MCU IO (13 pins), IO (17 pins), RS485 IO (10 pins)
NetC2_1: MCU IO (R8.1 U3.2), IO (C2.1 U1.4)
NetQ2_1: MCU IO (U3.3), IO (Q2.1 R21.2)
NetR18_2: MCU IO (U3.11), RS485 IO (R18.2 U5.2 U5.3)
NetU2_7: MCU IO (U3.8), IO (U2.7)
NetU3_5: MCU IO (U3.5), RS485 IO (U5.1)
NetU3_6: MCU IO (U3.6), RS485 IO (U5.4)
PGEC1: MCU IO (P4.5 P6.5 U3.12), IO (R22.1)
PGED1: MCU IO (P4.4 P6.4 U3.13), IO (Q1.1 R5.2)